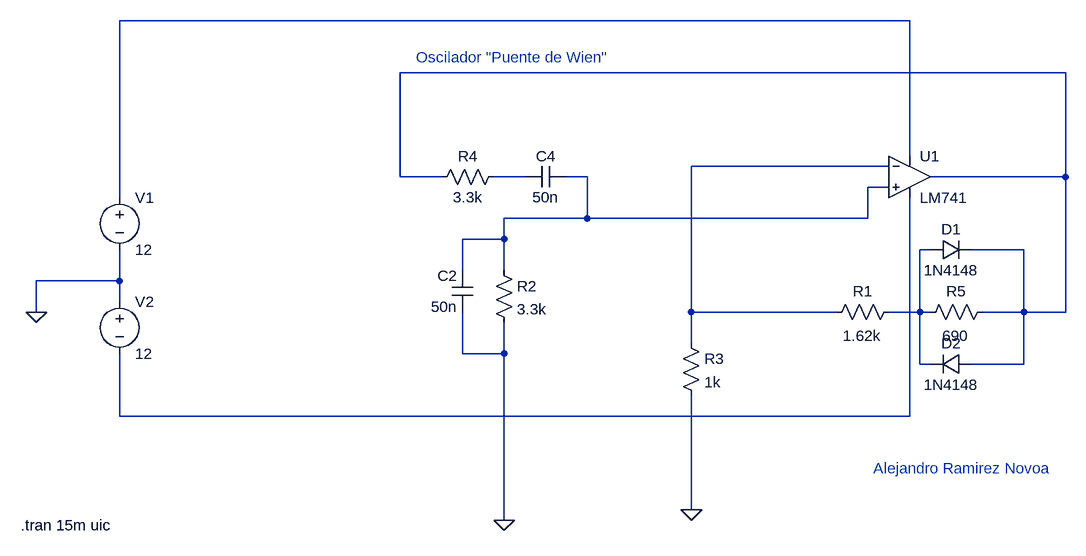
[diagram p0: schematic P weirn.asc]
P weirn.asc, the LTspice schematic file:
Version 4
SHEET 1 2452 772
WIRE 368 -96 -848 -96
WIRE 608 -16 -416 -16
WIRE 368 112 368 -96
WIRE 336 128 32 128
WIRE -416 144 -416 -16
WIRE -352 144 -416 144
WIRE -224 144 -272 144
WIRE -128 144 -160 144
WIRE 608 144 608 -16
WIRE 608 144 400 144
WIRE 336 160 304 160
WIRE -848 176 -848 -96
WIRE -128 208 -128 144
WIRE -128 208 -256 208
WIRE 304 208 304 160
WIRE 304 208 -128 208
WIRE -256 240 -256 208
WIRE -256 240 -320 240
WIRE 400 256 384 256
WIRE 544 256 464 256
WIRE -320 288 -320 240
WIRE -256 288 -256 240
WIRE -848 304 -848 256
WIRE -848 304 -976 304
WIRE -848 336 -848 304
WIRE -976 352 -976 304
WIRE 32 352 32 128
WIRE 256 352 32 352
WIRE 384 352 384 256
WIRE 384 352 336 352
WIRE 400 352 384 352
WIRE 544 352 544 256
WIRE 544 352 480 352
WIRE 608 352 608 144
WIRE 608 352 544 352
WIRE 32 400 32 352
WIRE -320 416 -320 352
WIRE -256 416 -256 368
WIRE -256 416 -320 416
WIRE 384 432 384 352
WIRE 400 432 384 432
WIRE 544 432 544 352
WIRE 544 432 464 432
WIRE -848 512 -848 416
WIRE 368 512 368 176
WIRE 368 512 -848 512
WIRE 32 656 32 480
WIRE -256 672 -256 416
FLAG 32 656 0
FLAG -976 352 0
FLAG -256 672 0
SYMBOL res 16 384 R0
SYMATTR InstName R3
SYMATTR Value 1k
SYMBOL res -272 272 R0
SYMATTR InstName R2
SYMATTR Value 3.3k
SYMBOL res -256 128 R90
WINDOW 0 0 56 VBottom 2
WINDOW 3 32 56 VTop 2
SYMATTR InstName R4
SYMATTR Value 3.3k
SYMATTR SpiceLine tol=1 pwr=0.1
SYMBOL voltage -848 160 R0
WINDOW 123 0 0 Left 0
WINDOW 39 0 0 Left 0
SYMATTR InstName V1
SYMATTR Value 12
SYMBOL voltage -848 320 R0
WINDOW 123 0 0 Left 0
WINDOW 39 0 0 Left 0
SYMATTR InstName V2
SYMATTR Value 12
SYMBOL res 352 336 R90
WINDOW 0 0 56 VBottom 2
WINDOW 3 37 57 VTop 2
SYMATTR InstName R1
SYMATTR Value 1.62k
SYMBOL cap -160 128 R90
WINDOW 0 0 32 VBottom 2
WINDOW 3 32 32 VTop 2
SYMATTR InstName C4
SYMATTR Value 50n
SYMBOL cap -304 352 R180
WINDOW 0 24 56 Left 2
WINDOW 3 24 8 Left 2
SYMATTR InstName C2
SYMATTR Value 50n
SYMBOL Opamps\\LM741 368 80 R0
SYMATTR InstName U1
SYMBOL res 496 336 R90
WINDOW 0 0 56 VBottom 2
WINDOW 3 37 57 VTop 2
SYMATTR InstName R5
SYMATTR Value 690
SYMBOL diode 400 272 R270
WINDOW 0 32 32 VTop 2
WINDOW 3 0 32 VBottom 2
SYMATTR InstName D1
SYMATTR Value 1N4148
SYMBOL diode 464 416 R90
WINDOW 0 0 32 VBottom 2
WINDOW 3 32 32 VTop 2
SYMATTR InstName D2
SYMATTR Value 1N4148
TEXT -1000 680 Left 2 !.tran 15m uic
TEXT 312 592 Left 2 ;Alejandro Ramirez Novoa
TEXT -392 -40 Left 2 ;Oscilador "Puente de Wien"

The netlist it stands for:
* P weirn.asc
R3 N003 0 1k
R2 N005 0 3.3k
R4 N004 N002 3.3k tol=1 pwr=0.1
V1 N001 0 12
V2 0 N007 12
R1 N006 N003 1.62k
C4 N005 N004 50n
C2 0 N005 50n
XU1 N005 N003 N001 N007 N002 LM741  ; pins In+ In- V+ V- OUT
R5 N002 N006 690
D1 N006 N002 1N4148
D2 N002 N006 1N4148
.model D D
.lib standard.dio
.tran 15m uic
* Alejandro Ramirez Novoa
* Oscilador "Puente de Wien"
.lib LM741.lib
.backanno
.end